# Altium schematic sheet AC-DC regulator.schdoc
size 127 x 99 mm
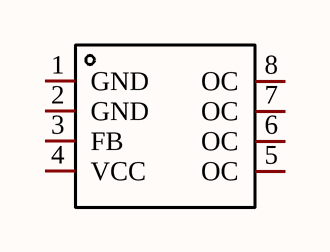
[diagram p0: AC-DC regulator.schdoc]

## Parts
U?  DK124  [DIP-8_L9.7-W6.4-P2.54-LS7.6-BL]  (value not drawn)

## Nets

Not connected (* = marked no-connect by the designer): U? 1(GND) 2(GND) 3(FB) 4(VCC) 5(OC) 6(OC) 7(OC) 8(OC)

## Library data of the parts
U? = DK124: Manufacturer: DK(东科半导体); Add into BOM: yes; Symbol: DK124; Device: DK124; LCSC Part Name: DK124; Supplier Part: C78752; Manufacturer Part: DK124; Supplier Footprint: DIP-8; JLCPCB Part Class: Extended Part; Datasheet: https://atta.szlcsc.com/upload/public/pdf/source/20170523/1495534039933.pdf; Supplier: LCSC; Convert to PCB: yes